# EAGLE design client_board (EAGLE 7.5.0)
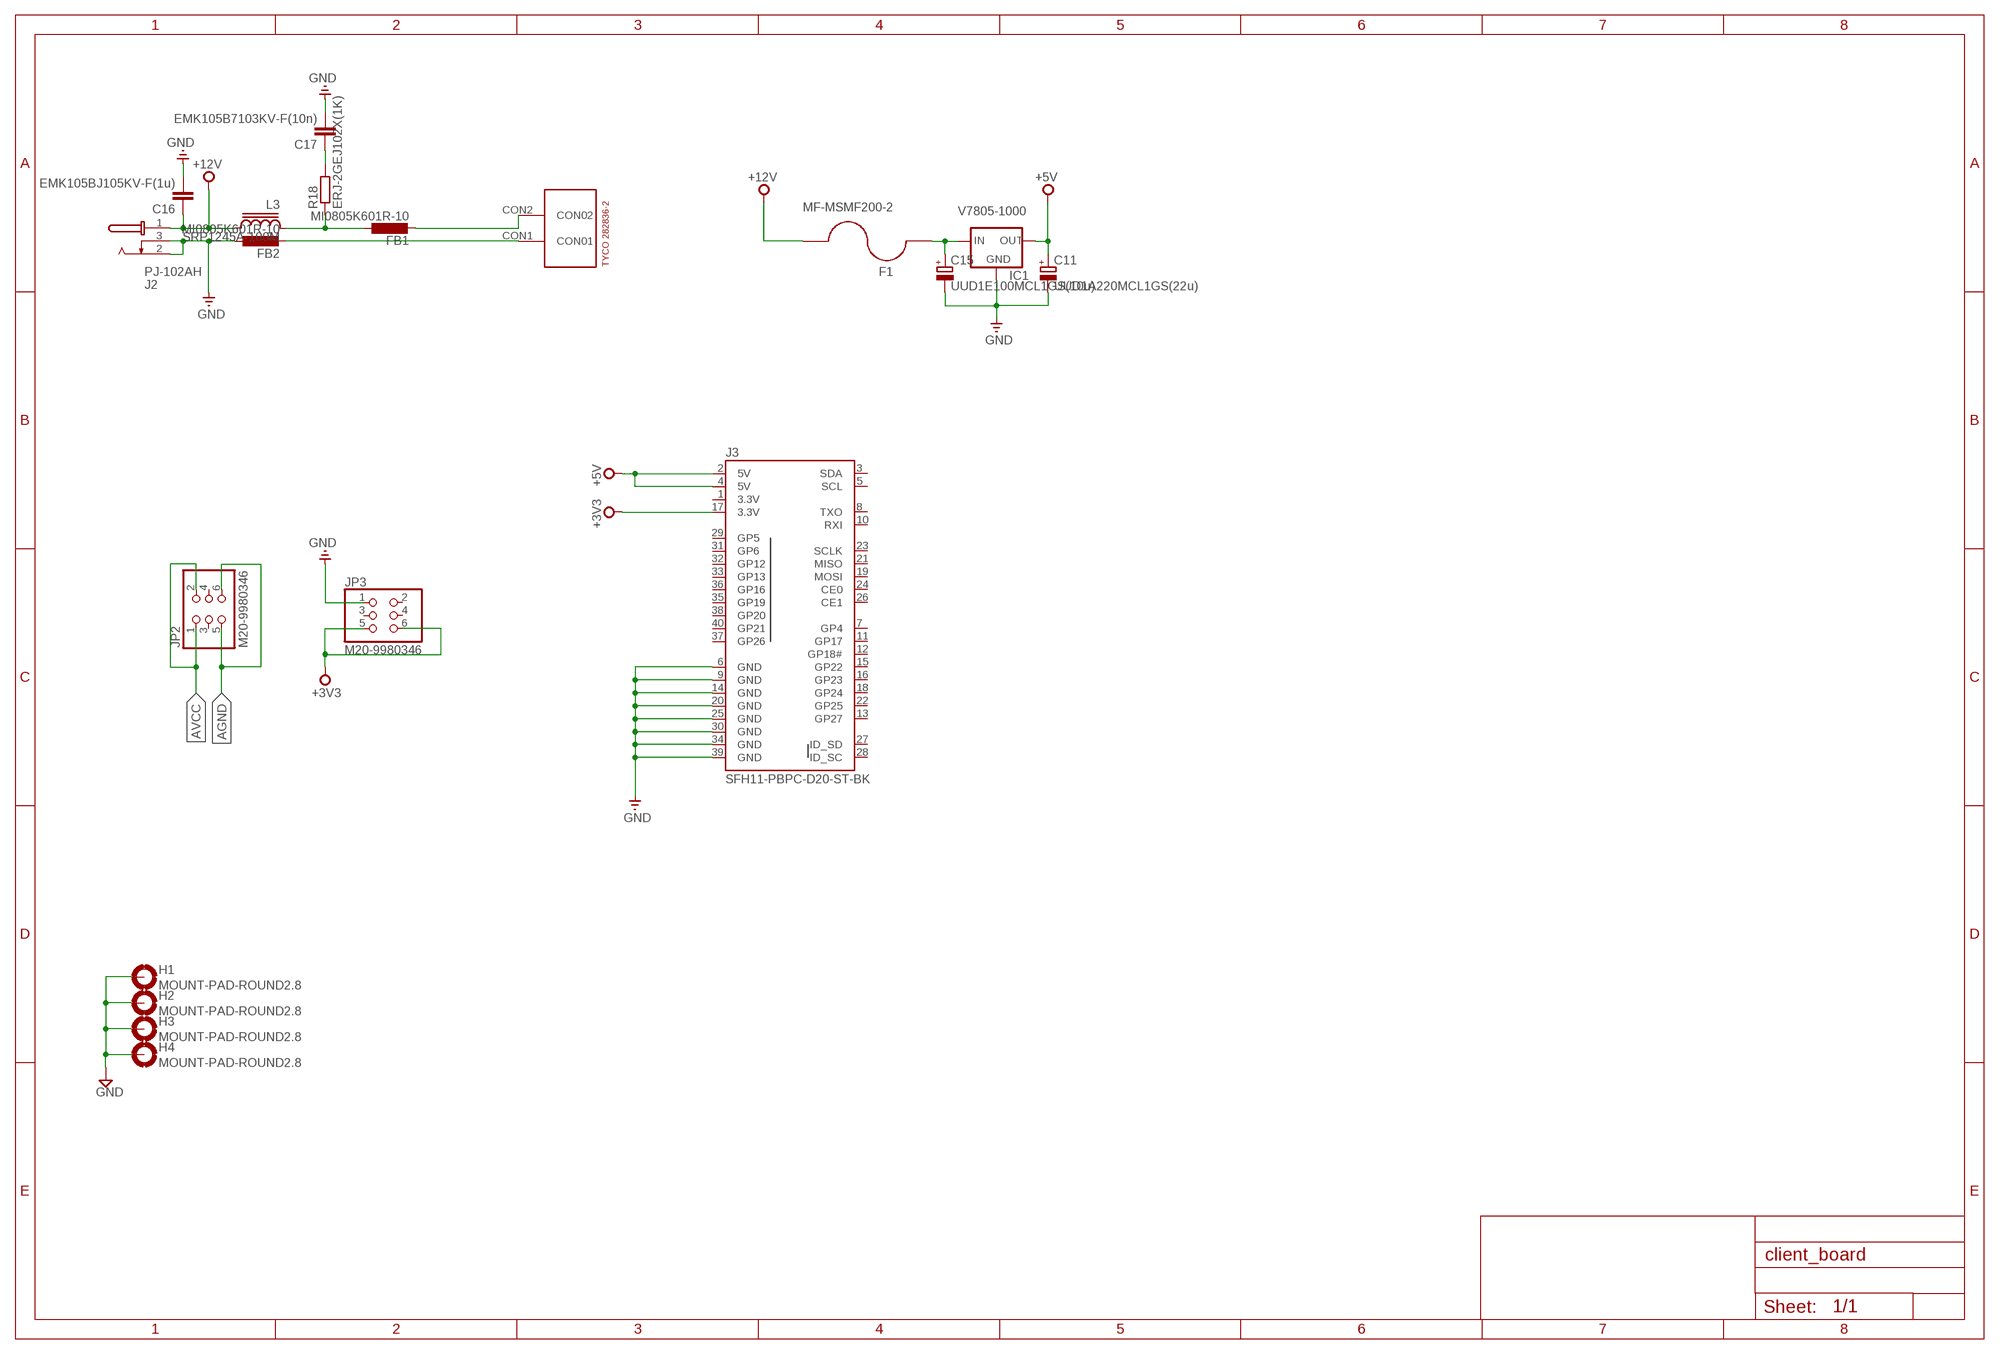
[diagram p0: schematic, sheet 1]

## Parts
C11  UUD1A220MCL1GS(22u)  CPOL-EU153CLV-0405  [153CLV-0405]
C15  UUD1E100MCL1GS(10u)  CPOL-EU153CLV-0405  [153CLV-0405]
C16  EMK105BJ105KV-F(1u)  C-EUC0402  [C0402]
C17  EMK105B7103KV-F(10n)  C-EUC0402  [C0402]
F1  MF-MSMF200-2  MF-MSMF075/24  [1812]
FB1  MI0805K601R-10  L-EUL5650M  [L5650M]
FB2  MI0805K601R-10  L-EUL5650M  [L5650M]
H1  MOUNT-PAD-ROUND2.8  [2,8-PAD]
H2  MOUNT-PAD-ROUND2.8  [2,8-PAD]
H3  MOUNT-PAD-ROUND2.8  [2,8-PAD]
H4  MOUNT-PAD-ROUND2.8  [2,8-PAD]
IC1  V7805-1000  VR_1OUTXX  [DIP_3PIN]
J2  PJ-102AH  PJ-102AH/BH  [PJ-102XH]
J3  SFH11-PBPC-D20-ST-BK  RASPBERRYPI-40-PIN-GPIO  [2X20-SHROUDED]
JP2  M20-9980346  PINHD-2X3  [2X03]
JP3  M20-9980346  PINHD-2X3  [2X03]
L3  SRP1245A-100M  SRP1250A  [SRP1250A]
R18  ERJ-2GEJ102X(1K)  R-EU_R0402  [R0402]
U$1  282836-2  [282836-2]

## Nets
+3V3: J3.17(3.3V) JP3.5 JP3.6
+5V: C11.+ IC1.OUT J3.2(5V) J3.4(5V)
+12V [VCC]: C16.1 F1.1 J2.1(T) L3.2
AGND [100ohm_differencial_pair]: FB2.2 JP2.5 JP2.6 U$1.CON1(CON01)
AVCC [100ohm_differencial_pair]: FB1.2 JP2.1 JP2.2 U$1.CON2(CON02)
GND [GND]: C11.- C15.- C16.2 C17.2 FB2.1 H1.B2,8(MOUNT) H2.B2,8(MOUNT) H3.B2,8(MOUNT) H4.B2,8(MOUNT) IC1.GND J2.2(S) J2.3(SS) J3.6(GND) J3.9(GND) J3.14(GND) J3.20(GND) J3.25(GND) J3.30(GND) J3.34(GND) J3.39(GND) JP3.1
N$4: C15.+ F1.2 IC1.IN
N$9 [VCC]: FB1.1 L3.1 R18.1
N$38: C17.1 R18.2
Unconnected: J3.3(SDA) J3.5(SCL) J3.7(GP4) J3.8(TXO) J3.10(RXI) J3.11(GP17) J3.12(GP18#) J3.13(GP27) J3.15(GP22) J3.16(GP23) J3.18(GP24) J3.19(MOSI) J3.21(MISO) J3.22(GP25) J3.23(SCLK) J3.24(CE0) J3.26(CE1) J3.27(ID_SD) J3.28(ID_SC) J3.29(GP5) J3.31(GP6) J3.32(GP12) J3.33(GP13) J3.35(GP19) J3.36(GP16) J3.37(GP26) J3.38(GP20) J3.40(GP21) JP2.3 JP2.4 JP3.2 JP3.3 JP3.4

## Notes on the sheet
- Hole

## Power pins joined to a net without a drawn wire
3.3V: J3.1(3.3V)

## Library data of the parts
C11 C15 = resistor:CPOL-EU: POLARIZED CAPACITOR, European symbol
C16 C17 = resistor:C-EU: CAPACITOR, European symbol
F1 = openblw:MF-MSMF*?: PTC Resettable Fuse Documentation Datasheet <http://www.bourns.com/data/global/pdfs/mfmsmf.pdf> Features Compliant with AEC-Q200 Rev-C- Stress Test Qualification for Passive Components in Automotive Applications 100% electrically compatible with all previous generations of 1812 SMT devices Compatible with Pb and Pb-free solder reflow profiles RoHS compliant* and halogen free** Surface mount packaging for automated assembly Standard 4532 mm (1812 mils) footprint Patents pending; CATEGORY: Circuit Protection; CURRENT-MAX: 40A; CURRENT-TRIP: 1.5A; DESCRIPTION: PTC RESETTABLE .75A 24V 1812; DOCUMENTATION_LINK: <a href="http://www.bourns.com/data/global/pdfs/mfmsmf.pdf">Datasheet</a>; DOCUMENTATION_URL: http://www.bourns.com/data/global/pdfs/mfmsmf.pdf; FAMILY: PTC Resettable Fuses; MANUFACTURER: Bourns Inc.; PACKAGE: 1812 (4532 Metric), Concave; PART_NUMBER: MF-MSMF075/24-2; R_MINMAX: 0.11 ~ 0.450 Ohm; SERIES: MF-MSMF; SUPPLIER_ITEM_LINK: <a href="http://www.digikey.com/product-detail/en/MF-MSMF075%2F24-2/MF-MSMF075%2F24-2CT-ND/662844">Details</a>; SUPPLIER_ITEM_NUMBER: MF-MSMF075/24-2CT-ND; SUPPLIER_ITEM_URL: http://www.digikey.com/product-detail/en/MF-MSMF075%2F24-2/MF-MSMF075%2F24-2CT-ND/662844; SUPPLIER_LINK: <a href="http://www.digikey.com">Home Page</a>; SUPPLIER_NAME: Digi-Key; SUPPLIER_URL: http://www.digikey.com; TIME_TO_TRIP: 0.2s; VOLTAGE-MAX: 24V
FB1 FB2 = resistor:L-EU: INDUCTOR, European symbol
H1-H4 = holes:MOUNT-PAD-ROUND: MOUNTING PAD, round
IC1 = openblw:VR_1OUT: VOLTAGE REGULATOR
J2 = con-dc-power:PJ-102AH/BH: DC Power Jack PJ-102AH (2.1 x 5.5 MM) PJ-102BH (2.5 x 5.5 MM)
J3 = SparkFun-Boards:RASPBERRYPI-40-PIN-GPIO: Second Generation Raspberry Pi GPIO Header 2x20 pin connector, as found on B, B+, A+ models.
JP2 JP3 = pinhead:PINHD-2X3: PIN HEADER
L3 = openblw:SRP1250A: POWER INDUCTOR
R18 = resistor:R-EU_: RESISTOR, European symbol
U$1 = openblw:282836-2: TYCO 282836-2 TERM BLOCK 2POS SIDE ENTRY 5MM EURISTYLE

## Net classes
1 GND: width 0.508 mm, drill 0.3 mm, clearance 0.2 mm to class 0, clearance 0.2 mm
2 100ohm_differencial_pair: width 0.254 mm, drill 0.3 mm, clearance 0.5 mm to class 0, clearance 0.5 mm to class 1, clearance 0.25 mm
3 VCC: width 0.508 mm, drill 0.3 mm, clearance 0.2 mm to class 0, clearance 0.4 mm to class 1, clearance 0.2 mm to class 2, clearance 0.2 mm

## Board
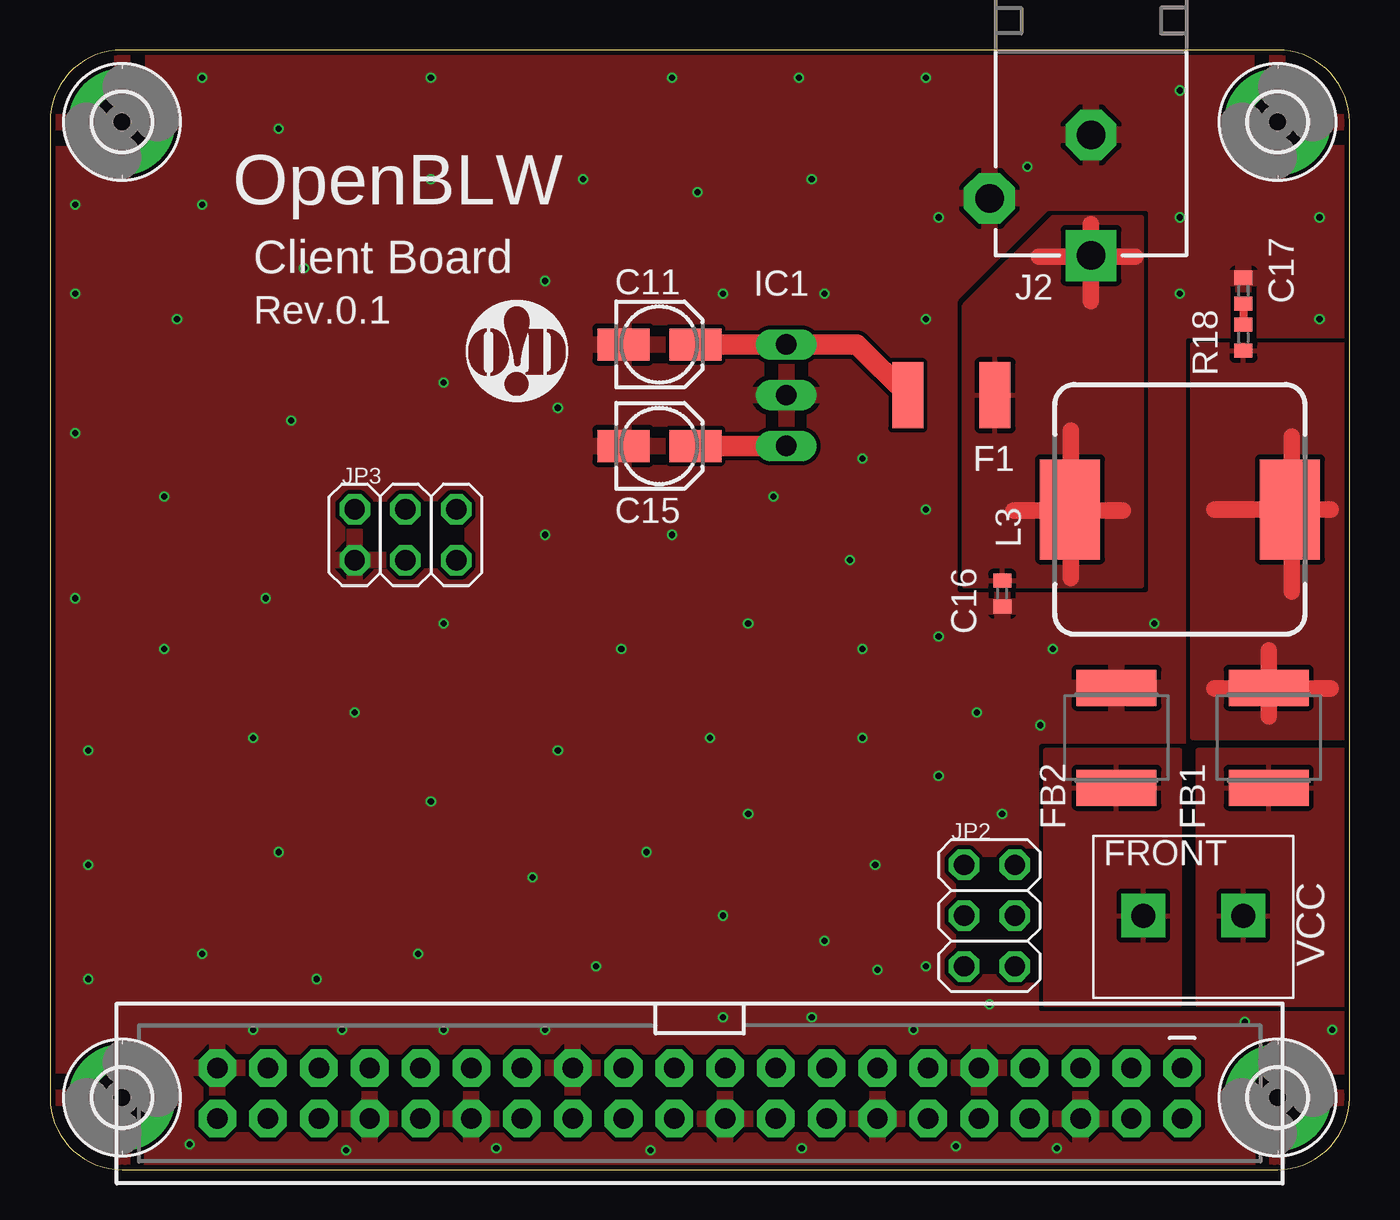
[diagram p1: board, top side]
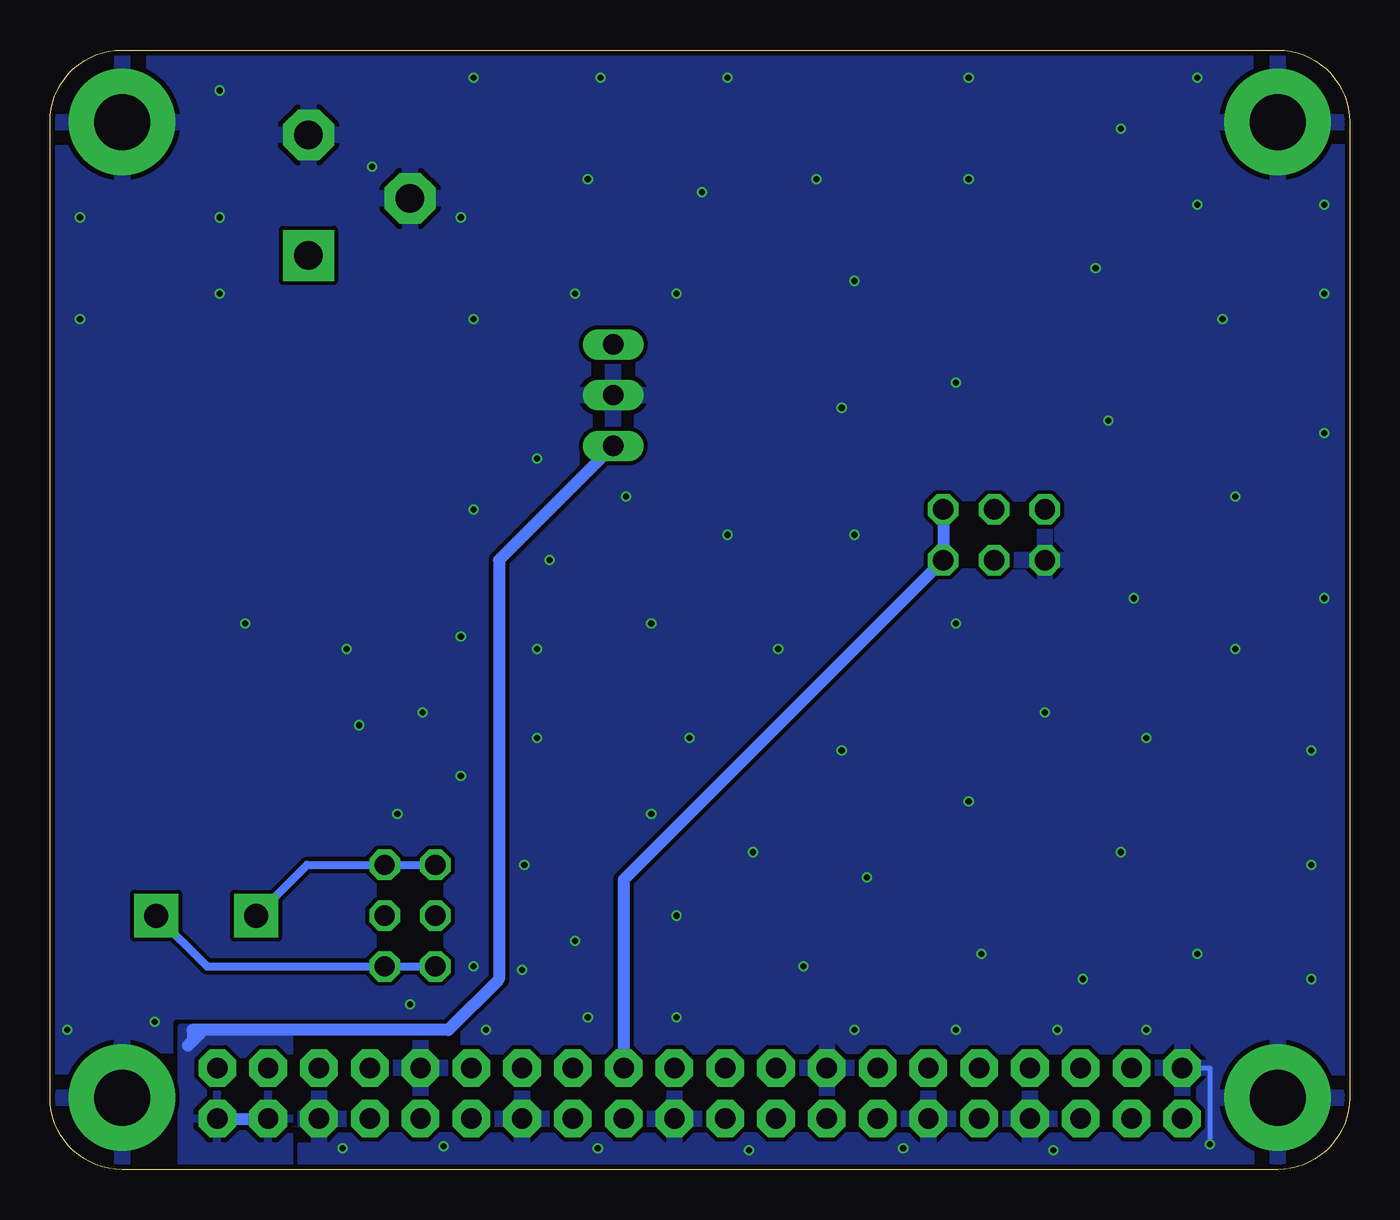
[diagram p2: board, bottom side, seen from below]

Size 65 x 56 mm. Coordinates in mm from the lower left corner, seen from the top.
Outline: 0,3.6 arc90 3.6,0 61.4,0 arc90 65,3.6 65,52.4 arc90 61.4,56 3.6,56 arc90 0,52.4 0,3.6
Copper layers (1*2*15*16): Top 0.035mm / dielectric 0.2mm / Route2 0.0175mm / dielectric 0.3mm / Route15 0.0175mm / dielectric 0.2mm / Bottom 0.035mm
Design rules "SeeedStudio_4layer_DRU_no_angle_20140221": minimum track width 8mil, minimum drill 12mil, track to track 8mil, track to pad 8mil, pad to pad 8mil, via to via 8mil, smd to smd 0mil, copper to edge 10mil, drill to drill 8mil, minimum pad ring 6mil, minimum via ring 4mil, stop-mask expansion 4mil, vias tented up to drill 25mil, thermal gap 10mil

### Footprints (pad centres in the part's own frame; a part is rotated, then mirrored left to right if it is on the bottom)
153CLV-0405 = smd 2.6 x 1.6: + 1.8,0; - -1.8,0
C0402 = smd 0.7 x 0.9: 1 -0.65,0; 2 0.65,0
1812 = smd 1.55 x 3.3: 1 -2.185,0; 2 2.185,0
L5650M = smd 1.8 x 4: 1 -2.5,0; 2 2.5,0
2,8-PAD = drill 2.8 pad 5.334: B2,8 0,0
DIP_3PIN = drill 1.016 long: GND 0,-2.54; IN -2.54,-2.54; OUT 2.54,-2.54
PJ-102XH = drill 1.422 pad 2.54 square: 1 0,0 | drill 1.422 pad 2.54 octagon: 2 0,-6.032; 3 5.08,-2.857
2X20-SHROUDED = drill 1.016 pad 1.88 octagon: 1 -1.27,24.13; 2 1.27,24.13; 3 -1.27,21.59; 4 1.27,21.59; 5 -1.27,19.05; 6 1.27,19.05; 7 -1.27,16.51; 8 1.27,16.51; 9 -1.27,13.97; 10 1.27,13.97; 11 -1.27,11.43; 12 1.27,11.43; 13 -1.27,8.89; 14 1.27,8.89; 15 -1.27,6.35; 16 1.27,6.35; 17 -1.27,3.81; 18 1.27,3.81; 19 -1.27,1.27; 20 1.27,1.27; 21 -1.27,-1.27; 22 1.27,-1.27; 23 -1.27,-3.81; 24 1.27,-3.81; 25 -1.27,-6.35; 26 1.27,-6.35; 27 -1.27,-8.89; 28 1.27,-8.89; 29 -1.27,-11.43; 30 1.27,-11.43; 31 -1.27,-13.97; 32 1.27,-13.97; 33 -1.27,-16.51; 34 1.27,-16.51; 35 -1.27,-19.05; 36 1.27,-19.05; 37 -1.27,-21.59; 38 1.27,-21.59; 39 -1.27,-24.13; 40 1.27,-24.13
2X03 = drill 1.016 octagon: 1 -2.54,-1.27; 2 -2.54,1.27; 3 0,-1.27; 4 0,1.27; 5 2.54,-1.27; 6 2.54,1.27
SRP1250A = smd 5 x 3: 1 0,5.5; 2 0,-5.5
R0402 = smd 0.7 x 0.9: 1 -0.65,0; 2 0.65,0
282836-2 = drill 1.2 pad 2.184 square: CON1 -2.46,0; CON2 2.54,0

### Placement (x,y rotation side)
C11  30.48,36.2 0 top
C15  30.48,41.27 0 top
C16  47.62,28.81 270 top
C17  59.69,43.95 90 top
F1  45.09,38.73 180 top
FB1  HR2220V801R-10  [L5650M]  60.96,21.59 270 top
FB2  HR2220V801R-10  [L5650M]  53.34,21.59 270 top
H1  3.6,3.6 0 top
H2  61.4,3.6 0 top
H3  3.6,52.4 0 top
H4  61.4,52.4 0 top
IC1  39.37,38.73 270 top
J2  52.07,45.72 180 top
J3  32.5,3.81 270 top
JP2  46.99,12.7 90 top
JP3  17.78,31.75 0 top
L3  56.52,33.02 270 top
LOGO1  [OHMYDIGIFAB_LOGO]  23.37,40.89 0 top
R18  59.69,41.61 90 top
U$1  57.15,12.7 0 top
U$2  [TENDA_P200]  49.53,8.89 90 top

### Tracks (layer width: path | path; a pad name or v marks a point on that pad's centre or on a via)
+3V3
  Bottom 0.61: J3.17 36.31,14.49 JP3.5 JP3.6
+5V
  Top 1.016: IC1.OUT C11.+
  Bottom 0.61: 58.1,6.2 57.87,6.43 | 57.87,6.43 57.31,6.99 | J3.2 J3.4 | IC1.OUT 42.55,30.48 42.55,9.53 45.09,6.99 57.87,6.99 57.87,6.43
  pour Bottom: 53.04,7.12 53.04,0.04 58.42,0.04 58.42,7.12
+12V
  Top 0.813: 50.8,33.02 L3.2 | 51.05,36.96 51.05,29.59 | 48.2,32.96 53.66,32.96 | 49.47,45.66 54.29,45.66 | 52.07,47.29 52.07,43.43
  pour Top: 45.72,43.18 45.72,29.21 54.61,29.21 54.61,47.62 50.16,47.62
AGND
  Bottom 0.406: U$1.CON1 52.15,15.24 JP2.5 JP2.6
  pour Top: 56.52,8.26 56.52,20.95 49.78,20.95 49.78,8.26
AVCC
  Bottom 0.406: U$1.CON2 57.15,10.16 JP2.1 JP2.2
  pour Top: 64.77,8.26 64.77,20.95 57.4,20.95 57.4,8.26
GND  (via drill 0.3)
  Bottom 0.254: J3.39 6.99,5.08 v6.99,1.27
  other vias: 1.27,48.26 7.62,54.61 19.05,54.61 19.05,49.53 11.43,52.07 12.7,45.09 7.62,48.26 26.67,49.53 1.27,43.81 12.06,37.47 6.35,42.55 1.27,36.83 5.71,33.66 10.79,28.57 1.27,28.57 5.71,26.04 10.16,21.59 1.91,20.95 1.91,9.53 1.91,15.24 11.43,15.88 7.62,10.79 13.34,9.53 14.8,0.97 22.32,1.07 30.05,0.97 37.6,1.07 45.32,1.17 50.37,1.07 41.4,9.98 59.76,7.38 64.14,6.99 33.66,7.62 18.41,10.79 19.05,18.41 28.57,26.04 15.24,22.86 29.84,15.88 33.66,12.7 19.68,27.3 24.13,14.61 25.4,20.95 34.92,27.3 43.81,33.02 33.66,43.81 25.4,38.1 24.77,44.45 38.1,49.53 31.11,31.75 19.68,39.37 32.38,48.9 46.35,22.86 33.02,21.59 34.92,17.78 38.73,11.43 38.1,7.62 46.99,8.26 41.27,15.24 37.47,54.61 31.11,54.61 43.81,54.61 44.45,47.62 38.73,43.81 40.64,35.56 40.01,30.48 40.64,26.04 40.64,21.59 44.45,19.68 47.62,17.78 43.18,6.99 44.45,26.67 50.16,26.04 55.24,27.3 63.5,42.55 63.5,47.62 56.52,53.98 48.9,50.16 56.52,47.62 43.81,42.55 56.52,43.81 36.2,33.66 24.77,31.75 49.53,22.23 10.16,6.99 14.61,6.99 19.68,6.99 24.77,6.99 27.3,10.16 43.81,10.16
  pour Top (rank 6): 0,55.88 0,0 65,0 65,56
  pour Bottom (rank 6): 0,55.88 0,0 65,0 65,56
N$4
  Top 1.016: C15.+ IC1.IN 40.36,41.27 F1.2
N$9
  Top 0.813: 62.12,28.92 62.12,36.67 | 64.07,24.07 58.23,24.07 | 60.96,22.67 60.96,25.97 | 64.07,33.02 58.23,33.02
  pour Top: 64.77,41.27 64.77,21.59 57.15,21.59 57.15,41.27
N$38
  Top 0.406: C17.1 R18.2

### Text on the board
tPlace: OpenBLW | Client Board | Rev.0.1 | VCC